# EAGLE design untitled (EAGLE 7.6.0)
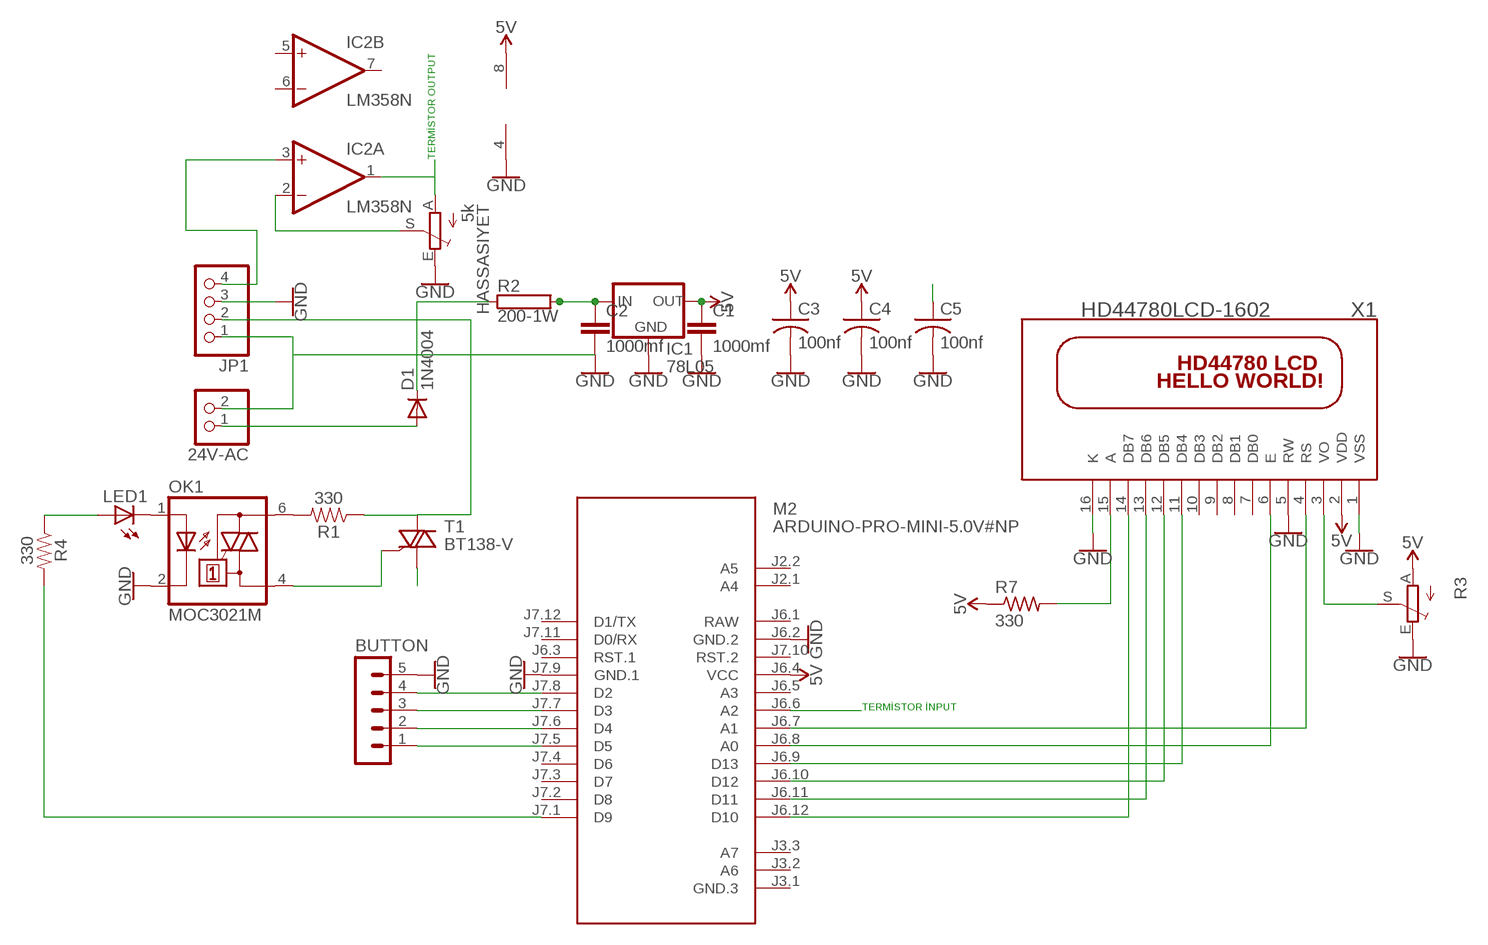
[diagram p0: schematic, sheet 1]

## Parts
24V-AC  PINHD-1X2  [1X02]
BUTTON  MA05-1  [MA05-1]
C1  1000mf  C5/3.5  [C5B3.5]
C2  1000mf  C5/3.5  [C5B3.5]
C3  100nf  C-USC1206  [C1206]
C4  100nf  C-USC1206  [C1206]
C5  100nf  C-USC1206  [C1206]
D1  1N4004  [DO41-10]
HASSASIYET  5k  TRIM_EU-S64W  [S64W]
IC1  78L05  78MXXS  [78MXXS]
IC2  LM358N  [DIL08]
JP1  PINHD-1X4  [1X04]
LED1  LED3MM  [LED3MM]
M2  ARDUINO-PRO-MINI-5.0V#NP  [ARDUINO-PRO-MINI#NP]
OK1  MOC3021M  [DIL06]
R1  330  1KOHM-HORIZ-1/4W-1%  [AXIAL-0.3]
R2  200-1W  RKH206-8R  [KH206-8R]
R3  TRIM_EU-CA6V  [CA6V]
R4  330  1KOHM-HORIZ-1/4W-1%  [AXIAL-0.3]
R7  330  R-US_0207/10  [0207/10]
T1  BT138-V  [TO220BV]
X1  HD44780LCD-1602  [LCD1602]

## Nets
5V: C1.1 C3.1 C4.1 IC1.OUT IC2.8(P:V+) M2.J6.4(VCC) R3.A R7.1 X1.2(VDD)
24V: C2.1 C5.1 IC1.IN R2.2
A2: HASSASIYET.A IC2.1(A:OUT) M2.J6.6(A2)
GND: 24V-AC.2 BUTTON.5 C1.2 C2.2 C3.2 C4.2 C5.2 HASSASIYET.E IC1.GND IC2.4(P:V-) JP1.1 JP1.3 M2.J6.2(GND.2) M2.J7.9(GND.1) OK1.2(C) R3.E X1.1(VSS) X1.5(RW) X1.16(K)
N$1: M2.J6.12(D10) X1.14(DB7)
N$2: BUTTON.4 M2.J7.8(D2)
N$3: LED1.K(C) OK1.1(A)
N$4: OK1.6(A2) R1.P$2
N$5: OK1.4(A1) T1.G
N$6: JP1.2 R1.P$1 T1.T2(A2)
N$8: M2.J6.11(D11) X1.13(DB6)
N$9: M2.J6.8(A0) X1.6(E)
N$10: D1.C R2.1
N$11: R3.S X1.3(VO)
N$12: M2.J6.10(D12) X1.12(DB5)
N$13: M2.J6.9(D13) X1.11(DB4)
N$14: M2.J6.7(A1) X1.4(RS)
N$15: LED1.A R4.P$1
N$16: M2.J7.1(D9) R4.P$2
N$17: R7.2 X1.15(A)
N$18: IC2.3(A:+IN) JP1.4
N$19: HASSASIYET.S IC2.2(A:-IN)
N$20: BUTTON.3 M2.J7.7(D3)
N$21: BUTTON.2 M2.J7.6(D4)
N$22: BUTTON.1 M2.J7.5(D5)
N$24: 24V-AC.1 D1.A T1.T1(A1)
Unconnected: IC2.5(B:+IN) IC2.6(B:-IN) IC2.7(B:OUT) M2.J2.1(A4) M2.J2.2(A5) M2.J3.1(GND.3) M2.J3.2(A6) M2.J3.3(A7) M2.J6.3(RST.1) M2.J6.5(A3) M2.J7.2(D8) M2.J7.3(D7) M2.J7.4(D6) M2.J7.10(RST.2) M2.J7.11(D0/RX) M2.J7.12(D1/TX) X1.7(DB0) X1.8(DB1) X1.9(DB2) X1.10(DB3)

## Notes on the sheet
- TERMİSTOR OUTPUT
- TERMİSTOR İNPUT

## Power pins joined to a net without a drawn wire
RAW: M2.J6.1(RAW)

## Library data of the parts
24V-AC = pinhead:PINHD-1X2: PIN HEADER
BUTTON = con-lstb:MA05-1: PIN HEADER; OC_FARNELL: unknown; OC_NEWARK: unknown
C1 C2 = capacitor-wima:C: CAPACITOR naming: grid - package width
C3-C5 = adafruit:C-US: CAPACITOR, American symbol
D1 = diode:1N4004: DIODE general purpose rectifier, 1 A
HASSASIYET R3 = pot:TRIM_EU-: POTENTIOMETER
IC1 = v-reg:78MXXS: VOLTAGE REGULATOR
IC2 = linear:LM358: OP AMP also LM158; LM258; LM2904 Source: http://cache.national.com/ds/LM/LM158.pdf
JP1 = pinhead:PINHD-1X4: PIN HEADER
LED1 = adafruit:LED: LED OSRAM: - CHIPLED LG R971, LG N971, LY N971, LG Q971, LY Q971, LO R971, LY R971 LH N974, LH R974 LS Q976, LO Q976, LY Q976 LO Q996 - Hyper CHIPLED LW Q18S LB Q993, LB Q99A, LB R99A - SideLED LS A670, LO A670, LY A670, LG A670, LP A670 LB A673, LV A673, LT A673, LW A673 LH A674 LY A675 LS A676, LA A676, LO A676, LY A676, LW A676 LS A679, LY A679, LG A679 - Hyper Micro SIDELED® LS Y876, LA Y876, LO Y876, LY Y876 LT Y87S - SmartLED LW L88C, LW L88S LB L89C, LB L89S, LG L890 LS L89K, LO L89K, LY L89K LS L896, LA L896, LO L896, LY L896 - TOPLED LS T670, LO T670, LY T670, LG T670, LP T670 LSG T670, LSP T670, LSY T670, LOP T670, LYG T670 LG T671, LOG T671, LSG T671 LB T673, LV T673, LT T673, LW T673 LH T674 LS T676, LA T676, LO T676, LY T676, LB T676, LH T676, LSB T676, LW T676 LB T67C, LV T67C, LT T67C, LS T67K, LO T67K, LY T67K, LW E67C LS E67B, LA E67B, LO E67B, LY E67B, LB E67C, LV E67C, LT E67C LW T67C LS T679, LY T679, LG T679 LS T770, LO T770, LY T770, LG T770, LP T770 LB T773, LV T773, LT T773, LW T773 LH T774 LS E675, LA E675, LY E675, LS T675 LS T776, LA T776, LO T776, LY T776, LB T776 LHGB T686 LT T68C, LB T68C - Hyper Mini TOPLED® LB M676 - Mini TOPLED Santana® LG M470 LS M47K, LO M47K, LY M47K Source: http://www.osram.convergy.de/
M2 = diy-modules:ARDUINO-PRO-MINI-*#NP: Arduino Pro Mini without programming pads
OK1 = optocoupler:MOC30*M: RANDOM-PHASE OPTOISOLATORS TRIAC DRIVER OUTPUT Source: http://www.fairchildsemi.com MOC3020-M.pdf; MF: FAIRCHILD SEMICONDUCTOR; MPN: MOC3021-M; OC_FARNELL: 1021365; OC_NEWARK: 95B7895
R1 R4 = SparkFun-Resistors:1KOHM: 1kΩ resistor A resistor is a passive two-terminal electrical component that implements electrical resistance as a circuit element. Resistors act to reduce current flow, and, at the same time, act to lower voltage levels within circuits. - Wikipedia; PROD_ID: RES-12182; VALUE: 1k
R2 = resistor-power:R: Power Resitor
R7 = resistor:R-US_: RESISTOR, American symbol
T1 = triac:BT138: TRIAC Source: http://www.semiconductors.philips.com BT138_SERIES_2.pdf
X1 = adafruit:HD44780LCD: HD44780 LCD Standard character type LCDs, available in sizes from 8x1 to 40x4!

## Board
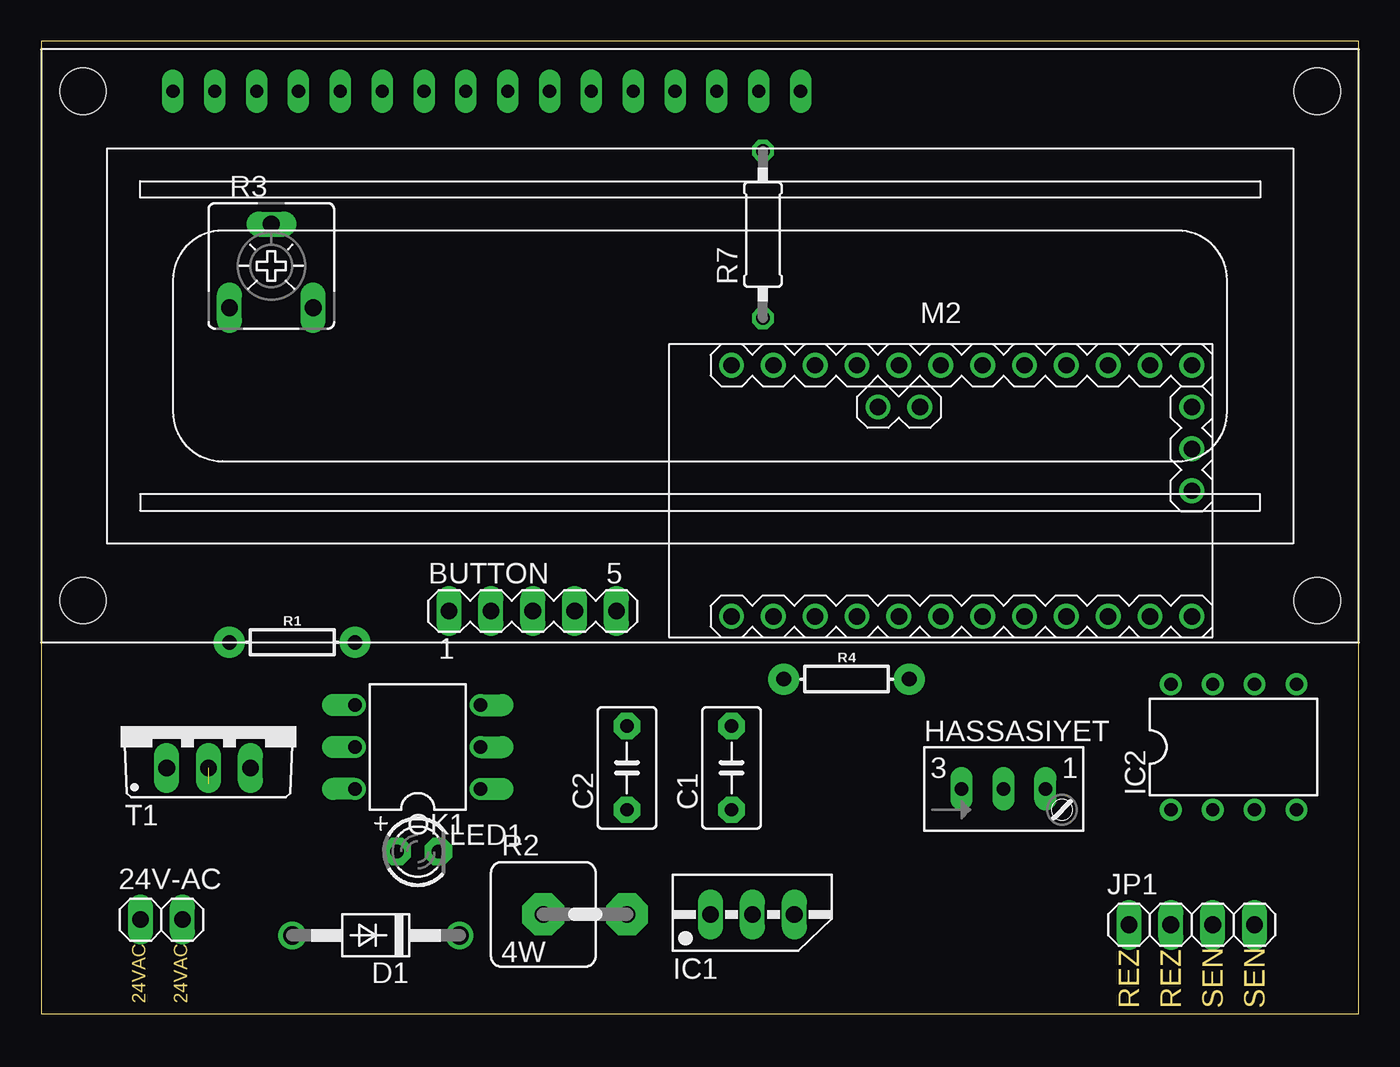
[diagram p1: board, top side]
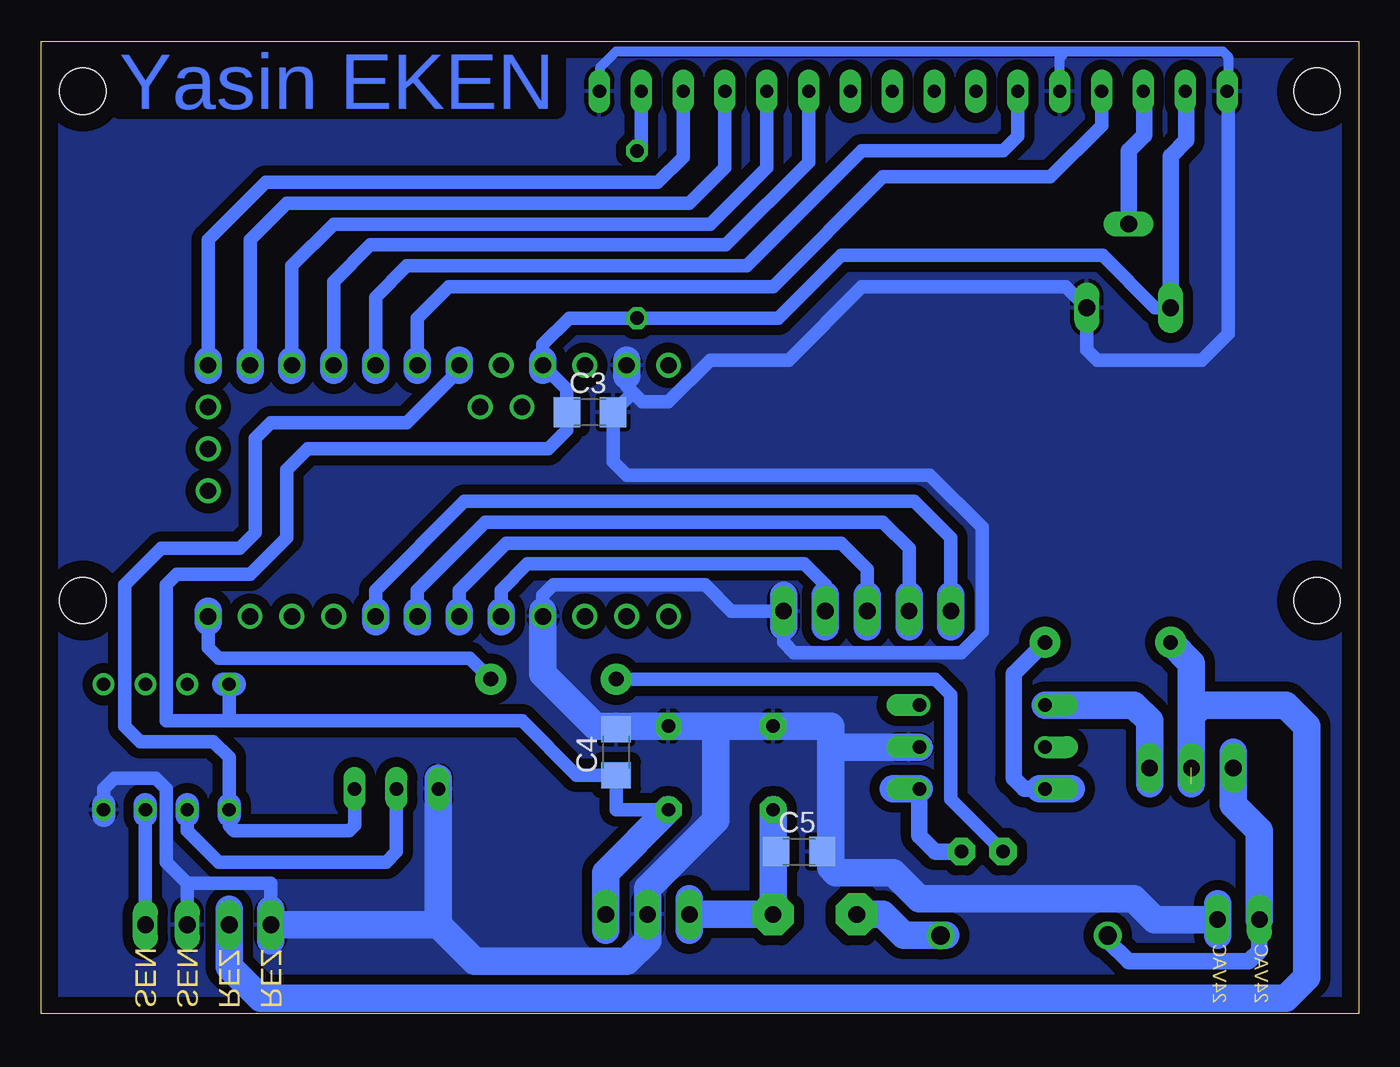
[diagram p2: board, bottom side, seen from below]

Size 79.99 x 59.04 mm. Coordinates in mm from the lower left corner, seen from the top.
Outline: 0,0 79.99,0 79.99,59.04 0,59.04 0,0
Copper layers (1*16): Top 0.035mm / dielectric 1.5mm / Bottom 0.035mm
Design rules "default": minimum track width 10mil, minimum drill 24mil, track to track 8mil, track to pad 8mil, pad to pad 8mil, via to via 8mil, smd to smd 8mil, copper to edge 40mil, drill to drill 8mil, minimum pad ring 10mil, minimum via ring 8mil, stop-mask expansion 4mil, vias tented up to drill 0mil, thermal gap 10mil

### Footprints (pad centres in the part's own frame; a part is rotated, then mirrored left to right if it is on the bottom)
1X02 = drill 1.016 long: 1 -1.27,0; 2 1.27,0
MA05-1 = drill 1.016 long: 1 -5.08,0; 2 -2.54,0; 3 0,0; 4 2.54,0; 5 5.08,0
C5B3.5 = drill 0.813 pad 1.6 octagon: 1 -2.54,0; 2 2.54,0
C1206 = smd 1.6 x 1.8: 1 -1.4,0; 2 1.4,0
DO41-10 = drill 1.118: A 5.08,0; C -5.08,0
S64W = drill 0.813 long: A 2.54,1.27; E -2.54,1.27; S 0,1.27
78MXXS = drill 1.016 long: GND 0,-2.54; IN -2.54,-2.54; OUT 2.54,-2.54
DIL08 = drill 0.813 pad 1.27: 1 -3.81,-3.81; 2 -1.27,-3.81; 3 1.27,-3.81; 4 3.81,-3.81; 5 3.81,3.81; 6 1.27,3.81; 7 -1.27,3.81; 8 -3.81,3.81
1X04 = drill 1.016 long: 1 -3.81,0; 2 -1.27,0; 3 1.27,0; 4 3.81,0
LED3MM = drill 0.813 pad 1.676 octagon: A -1.27,0; K 1.27,0
ARDUINO-PRO-MINI#NP = drill 1: J2.1 -1.27,5.08; J2.2 -3.81,5.08; J3.1 15.24,0; J3.2 15.24,2.54; J3.3 15.24,5.08; J6.1 -12.7,7.62; J6.2 -10.16,7.62; J6.3 -7.62,7.62; J6.4 -5.08,7.62; J6.5 -2.54,7.62; J6.6 0,7.62; J6.7 2.54,7.62; J6.8 5.08,7.62; J6.9 7.62,7.62; J6.10 10.16,7.62; J6.11 12.7,7.62; J6.12 15.24,7.62; J7.1 15.24,-7.62; J7.2 12.7,-7.62; J7.3 10.16,-7.62; J7.4 7.62,-7.62; J7.5 5.08,-7.62; J7.6 2.54,-7.62; J7.7 0,-7.62; J7.8 -2.54,-7.62; J7.9 -5.08,-7.62; J7.10 -7.62,-7.62; J7.11 -10.16,-7.62; J7.12 -12.7,-7.62
DIL06 = drill 0.813 offset: 1 -2.54,-3.81; 2 0,-3.81; 3 2.54,-3.81; 4 2.54,3.81; 5 0,3.81; 6 -2.54,3.81
AXIAL-0.3 = drill 0.9 pad 1.88: P$1 -3.81,0; P$2 3.81,0
KH206-8R = drill 1.016 pad 2.54 octagon: 1 -2.54,0; 2 2.54,0
CA6V = drill 1.016 long: A -2.54,-2.54; E 2.54,-2.54; S 0,2.54
0207/10 = drill 0.813 octagon: 1 -5.08,0; 2 5.08,0
TO220BV = drill 1.016 long: G 2.54,-2.54; T1 -2.54,-2.54; T2 0,-2.54
LCD1602 = drill 0.8 long: 1 8,33.46; 2 10.54,33.46; 3 13.08,33.46; 4 15.62,33.46; 5 18.16,33.46; 6 20.7,33.46; 7 23.24,33.46; 8 25.78,33.46; 9 28.32,33.46; 10 30.86,33.46; 11 33.4,33.46; 12 35.94,33.46; 13 38.48,33.46; 14 41.02,33.46; 15 43.56,33.46; 16 46.1,33.46 | hole 2.8: 2.54,2.54; 2.54,33.46; 77.46,33.46; 77.46,2.54

### Placement (x,y rotation side)
24V-AC  7.3,5.71 0 top
BUTTON  29.84,24.45 0 top
C1  41.91,14.92 90 top
C2  35.56,14.92 90 top
C3  46.67,36.51 0 bottom
C4  45.09,15.88 90 bottom
C5  33.97,9.84 0 bottom
D1  20.32,4.76 180 top
HASSASIYET  58.42,12.38 0 top
IC1  43.18,8.57 0 top
IC2  72.39,16.19 0 top
JP1  69.85,5.4 0 top
LED1  22.86,9.84 0 top
M2  54.61,31.75 0 top
OK1  22.86,16.19 90 top
R1  15.24,22.54 0 top
R2  33.02,6.03 0 top
R3  13.97,45.4 0 top
R4  48.9,20.32 0 top
R7  43.81,47.31 90 top
T1  10.16,17.46 0 top
X1  0,22.54 0 top

### Tracks (layer width: path | path; a pad name or v marks a point on that pad's centre or on a via)
5V
  Bottom 0.61: C4.1 45.09,13.97
  Bottom 0.813: R3.A 12.38,42.86 15.56,46.04 31.43,46.04 35.24,42.23 R7.1 47.94,42.23 49.53,40.64 49.53,39.69 M2.J6.4 | 68.58,17.78 72.39,17.78 72.39,26.04 71.75,26.67 67.31,26.67 65.09,28.89 65.09,33.02 63.82,34.29 49.21,34.29 48.07,35.43 C3.1 48.07,37.91 M2.J6.4 | 68.58,17.78 50.8,17.78 47.49,14.47 C4.1 | C1.1 45.09,12.38 45.09,13.97 | 49.53,39.05 M2.J6.4 | IC2.8 68.58,17.78
  Bottom 1.016: IC1.OUT 45.72,6.35 | R3.A 11.43,52.07 10.48,53.02 10.48,55.94 X1.2
  Bottom 1.676: 45.72,5.08 45.72,6.35 45.72,6.99 45.72,8.57 C1.1 | 49.53,39.05 49.53,39.69
24V
  Bottom 0.813: C5.1 35.37,6.22 R2.2
  Bottom 1.016: 40.32,6.03 IC1.IN | R2.2 C2.1
  Bottom 1.676: 40.32,6.03 R2.2 | 35.56,5.71 C2.1
A2
  Bottom 0.813: HASSASIYET.A 60.96,11.43 61.28,11.11 68.26,11.11 68.58,11.43 68.58,12.06 IC2.1 68.58,12.7 68.58,15.56 69.53,16.51 73.98,16.51 74.93,17.46 74.93,26.04 72.71,28.26 67.94,28.26 66.99,29.21 66.99,34.92 66.04,35.88 57.78,35.88 54.61,39.05 M2.J6.6
  Bottom 1.422: 68.58,12.06 68.58,12.7
  Bottom 1.676: 54.61,39.05 54.61,39.69
GND
  Bottom 0.61: X1.5 18.16,58.04 17.78,58.42 | 17.78,58.42 8.26,58.42 7.94,58.1 7.94,56.06 X1.1 | X1.16 46.04,56.06 46.04,57.47 45.09,58.42 17.78,58.42 | C4.2 46.17,17.27 46.51,17.62
  Bottom 0.813: IC2.4 76.2,12.7 76.2,13.65 75.56,14.29 73.03,14.29 72.39,13.65 72.39,9.21 71.12,7.94 | 71.12,7.94 JP1.3 | JP1.1 66.04,6.35 66.04,7.94 71.12,7.94 | 44.13,37.78 43.5,37.15 41.91,37.15 39.37,39.69 34.61,39.69 30.16,44.13 17.78,44.13 R3.E 16.51,40.32 15.88,39.69 9.53,39.69 7.94,41.27 7.94,55.94 X1.1 | 44.13,37.78 44.45,38.1 44.45,38.73 M2.J6.2 | C5.2 32.38,9.84 32.07,9.53 | 49.53,20.64 49.53,23.81 | 44.13,37.78 44.13,37.65 C3.2 45.27,33.52 44.45,32.7 26.04,32.7 22.86,29.53 22.86,23.18 24.13,21.91 34.29,21.91 34.92,22.54 34.92,23.5 BUTTON.5 38.1,24.45 39.69,26.04 48.9,26.04 49.53,25.4 49.53,24.45
  Bottom 1.016: 49.53,20.64 46.51,17.62 46.35,17.46
  Bottom 1.422: 76.2,12.7 76.2,12.06
  Bottom 1.676: 39.05,17.46 C2.2 32.07,17.46 32.07,16.19 | 39.05,17.46 C1.2 46.35,17.46 49.53,20.64 M2.J7.9 | 24V-AC.2 12.38,5.71 13.65,6.99 26.67,6.99 28.26,8.57 31.75,8.57 32.07,8.89 32.07,9.53 32.07,16.19 | JP1.1 55.88,5.4 | 55.88,5.4 HASSASIYET.E 55.88,14.29 | 39.05,17.46 39.05,11.75 43.18,7.62 IC1.GND 43.18,4.45 44.45,3.17 53.66,3.17 55.88,5.4 | OK1.2 32.07,16.19 | 66.04,4.45 66.04,6.35 | 49.53,23.81 M2.J7.9 | M2.J7.9 49.53,24.45 | 34.92,23.5 34.92,25.4 | 44.45,38.73 44.45,39.69
  pour Bottom (isolate 0.61): 0,0 80.01,0 80.01,59.05 0,59.05
N$1
  Bottom 0.813: X1.14 41.02,52.01 42.55,50.48 66.36,50.48 69.85,46.99 69.85,39.69 M2.J6.12
  Bottom 1.676: 69.85,39.69 69.85,39.05
N$2
  Bottom 0.813: BUTTON.4 32.38,25.4 32.38,26.04 33.66,27.3 50.48,27.3 52.07,25.72 52.07,24.45 M2.J7.8
  Bottom 1.676: 52.07,23.81 52.07,24.45 | 32.38,23.5 32.38,25.4
N$3
  Bottom 1.016: LED1.K 25.72,9.84 26.67,10.79 OK1.1
  Bottom 1.676: OK1.1 28.26,13.65
N$4
  Bottom 1.016: R1.P$2 20.95,20.64 20.95,14.29 20.32,13.65 19.37,13.65 OK1.6
  Bottom 1.676: 19.37,13.65 17.46,13.65
N$5
  Bottom 1.016: T1.G 12.7,17.78
  Bottom 1.676: OK1.4 17.46,18.73 13.65,18.73 12.7,17.78 12.7,13.97
N$6  (1 unrouted)
  Bottom 1.016: 10.16,17.78 10.16,21.27
  Bottom 1.676: 10.16,18.1 10.16,17.78 10.16,15.88 10.16,13.97 | 10.16,18.1 9.53,18.73 4.45,18.73 3.17,17.46 3.17,2.22 4.45,0.95 66.67,0.95 68.58,2.86 JP1.2 | 68.58,6.03 JP1.2 | JP1.2 68.58,6.35 | 10.16,18.1 10.16,21.27 R1.P$1
N$7
  Bottom 1.676: 40.64,5.08 40.64,6.99
N$8
  Bottom 0.813: X1.13 38.48,51.37 40.64,49.21 65.09,49.21 67.31,46.99 67.31,39.69 M2.J6.11
  Bottom 1.676: 67.31,39.69 67.31,39.05
N$9
  Bottom 0.813: X1.6 20.7,53.28 21.59,52.39 30.16,52.39 37.15,45.4 57.78,45.4 59.69,43.5 59.69,39.69 M2.J6.8
  Bottom 1.676: 59.69,39.69 59.69,39.05
N$10
  Bottom 1.016: D1.C 27.3,4.76 28.57,6.03 28.89,6.03
  Bottom 1.676: 25.08,4.76 27.62,4.76 28.89,6.03 R2.1
N$11
  Bottom 1.016: R3.S 13.97,52.39 13.02,53.34 13.02,55.94 X1.3
N$12
  Bottom 0.813: X1.12 35.94,51.37 39.37,47.94 62.23,47.94 64.77,45.4 64.77,39.69 M2.J6.10
  Bottom 1.676: 64.77,39.69 64.77,39.05
N$13
  Bottom 0.813: X1.11 33.4,51.69 38.42,46.67 60.01,46.67 62.23,44.45 62.23,39.69 M2.J6.9
  Bottom 1.676: 62.23,39.69 62.23,39.05
N$14
  Bottom 0.813: X1.4 15.62,53.91 18.73,50.8 28.89,50.8 35.56,44.13 55.24,44.13 57.15,42.23 57.15,39.69 M2.J6.7
  Bottom 1.676: 57.15,39.69 57.15,39.05
N$15
  Bottom 0.813: LED1.A 24.77,13.02 24.77,19.37 25.72,20.32 R4.P$1
N$16
  Bottom 0.813: R4.P$2 53.98,21.59 69.22,21.59 69.85,22.23 69.85,23.81 M2.J7.1
  Bottom 1.676: 69.85,23.81 69.85,24.45
N$17
  Bottom 0.813: R7.2 43.56,52.64 X1.15
N$18
  Bottom 0.813: JP1.4 73.66,12.06 IC2.3
  Bottom 1.422: 73.66,12.06 73.66,12.7
N$19
  Bottom 0.813: HASSASIYET.S 58.42,9.84 59.05,9.21 69.22,9.21 71.12,11.11 71.12,12.06 IC2.2
  Bottom 1.422: 71.12,12.06 71.12,12.7
N$20
  Bottom 0.813: BUTTON.3 29.84,25.4 29.84,26.99 31.43,28.57 51.75,28.57 54.61,25.72 54.61,24.45 M2.J7.7
  Bottom 1.676: 54.61,23.81 54.61,24.45 | 29.84,23.5 29.84,25.4
N$21
  Bottom 0.813: BUTTON.2 27.3,25.4 27.3,28.26 28.89,29.84 53.02,29.84 57.15,25.72 57.15,24.45 M2.J7.6
  Bottom 1.676: 57.15,23.81 57.15,24.45 | 27.3,23.5 27.3,25.4
N$22
  Bottom 0.813: BUTTON.1 24.77,25.4 24.77,28.89 26.99,31.11 54.29,31.11 59.69,25.72 59.69,24.45 M2.J7.5
  Bottom 1.676: 59.69,23.81 59.69,24.45 | 24.77,23.5 24.77,25.4
N$23
  Bottom 1.676: 8.57,4.76 8.57,6.67
N$24
  Bottom 1.016: D1.A 15.24,4.45 13.97,3.17 6.67,3.17 6.03,3.81 24V-AC.1
  Bottom 1.676: 24V-AC.1 6.03,11.11 7.62,12.7 T1.T1 7.62,15.88
N$25
  Bottom 1.422: 68.26,20 68.9,20

### Text on the board
Bottom: Yasin EKEN
Dimension: 24VAC | 24VAC | REZ | REZ | SEN | SEN